# EAGLE design Simple (EAGLE 7.7.0)
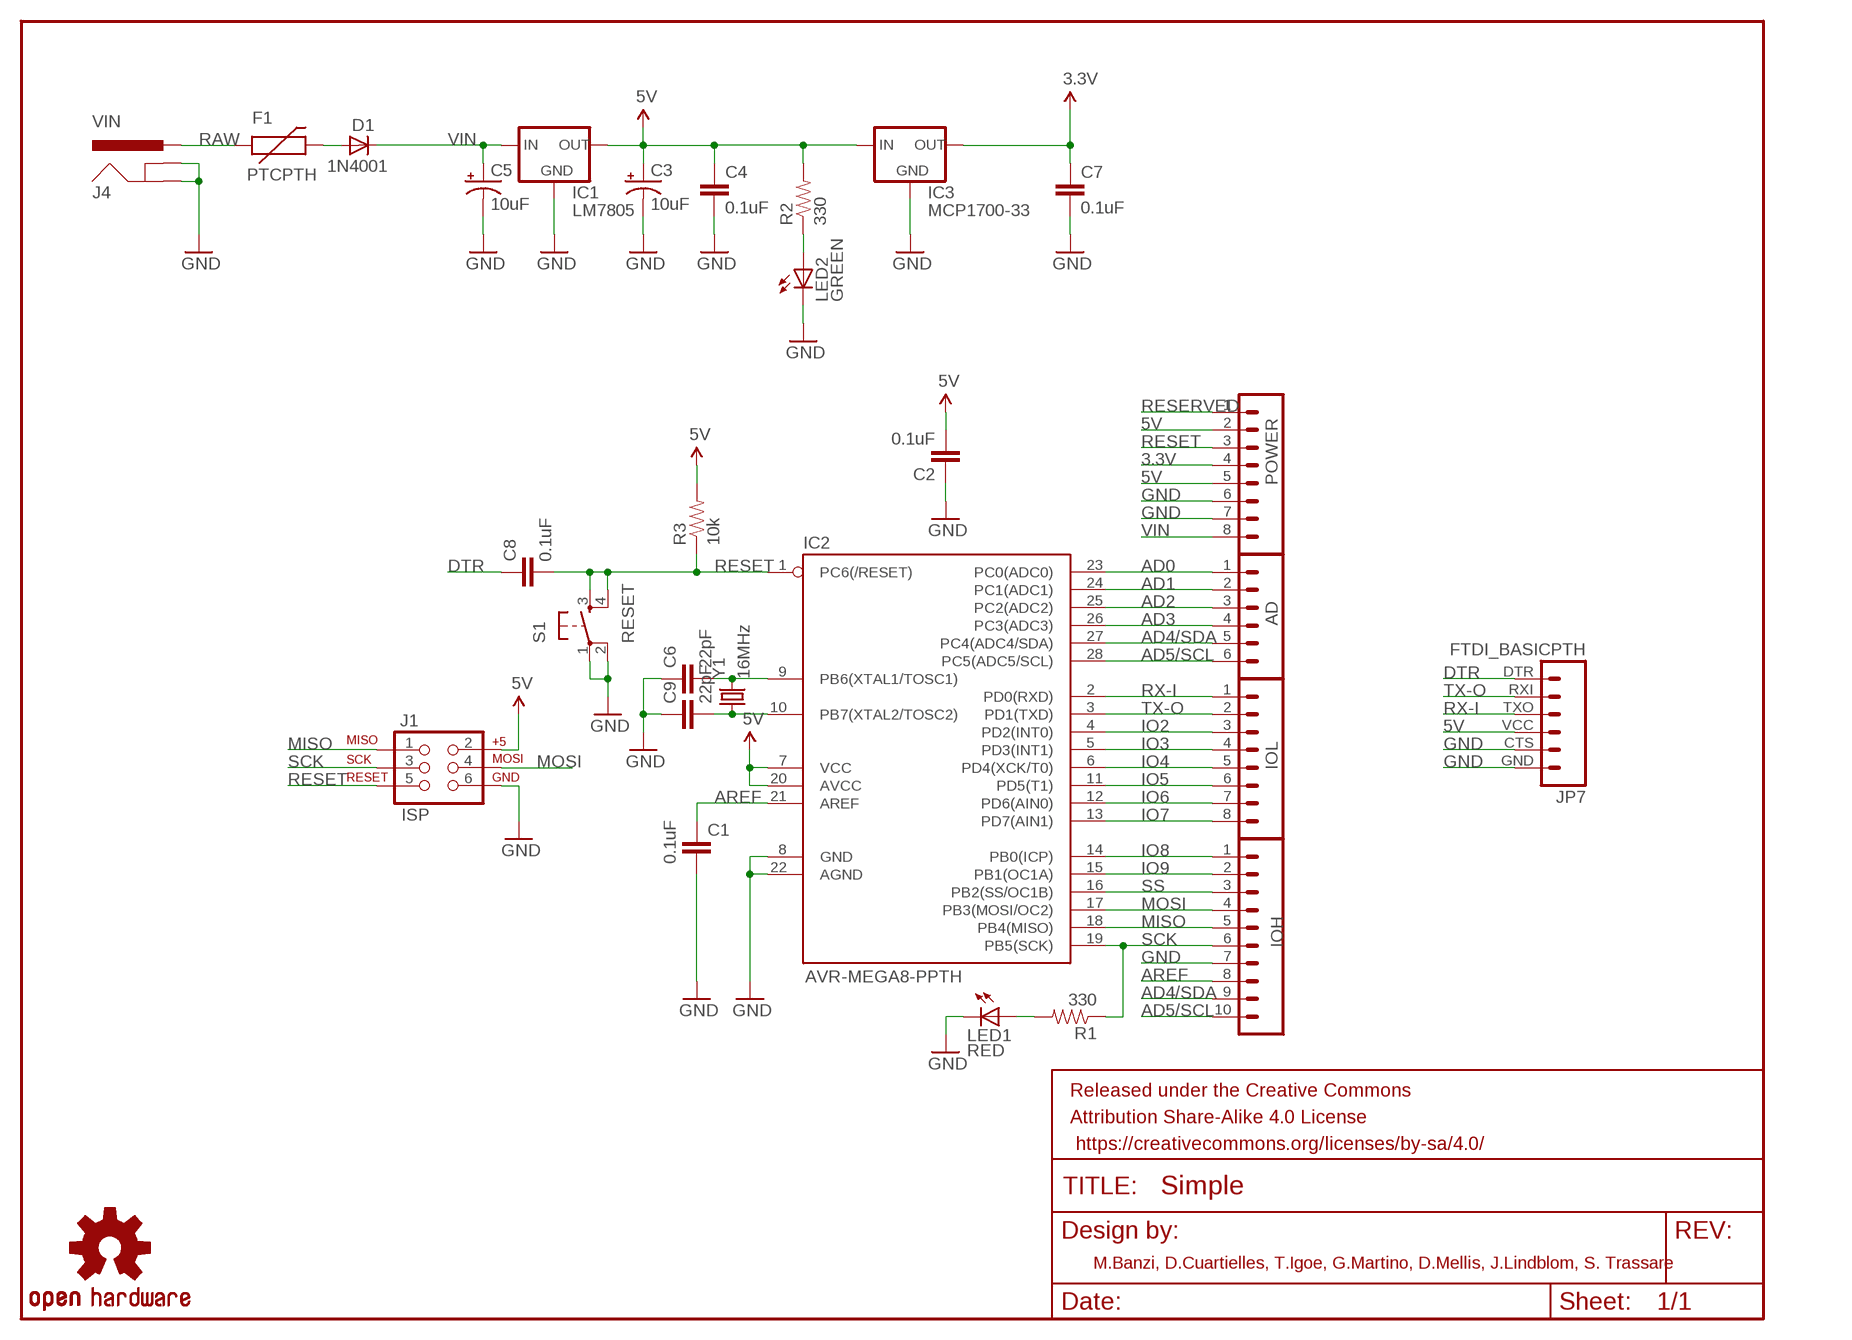
[diagram p0: schematic, sheet 1]

## Parts
AD  M06SIP  [1X06]
C1  0.1uF  CAPPTH2  [CAP-PTH-SMALL2]
C2  0.1uF  CAPPTH2  [CAP-PTH-SMALL2]
C3  10uF  CAP_POLPTH2  [CPOL-RADIAL-10UF-25V]
C4  0.1uF  CAPPTH2  [CAP-PTH-SMALL2]
C5  10uF  CAP_POLPTH2  [CPOL-RADIAL-10UF-25V]
C6  22pF  CAPPTH2  [CAP-PTH-SMALL2]
C7  0.1uF  CAPPTH2  [CAP-PTH-SMALL2]
C8  0.1uF  CAPPTH2  [CAP-PTH-SMALL2]
C9  22pF  CAPPTH2  [CAP-PTH-SMALL2]
D1  1N4001  DIODEPTH  [DIODE-1N4001]
F1  PTCPTH  [PTC]
FRAME2  FRAME-LETTER  [CREATIVE_COMMONS]
IC1  LM7805  V_REG_78XX-TO-220  [TO-220-ALT]
IC2  AVR-MEGA8-PPTH  [DIL28-3]
IC3  MCP1700-33  V_REG_78XXTO-92  [TO-92]
IOH  IOH  CONN_10"  [1X10]
IOL  M081X08  [1X08]
J1  ISP  AVR_SPI_PRG_6PTH  [2X3]
J4  VIN  POWER_JACKPTH_LOCK  [POWER_JACK_PTH_LOCK]
JP7  FTDI_BASICPTH  [FTDI_BASIC]
LED1  RED  LED5MM  [LED5MM]
LED2  GREEN  LED5MM  [LED5MM]
POWER  POWER  M081X08  [1X08]
R1  330  RESISTORAXIAL-0.3  [AXIAL-0.3]
R2  330  RESISTORAXIAL-0.3  [AXIAL-0.3]
R3  10k  RESISTORAXIAL-0.3  [AXIAL-0.3]
S1  RESET  TAC_SWITCHPTH  [TACTILE-PTH]
U$7  OSHW-LOGOM  [OSHW-LOGO-M]
Y1  16MHz  CRYSTALHC49US  [HC49US]

## Nets
3.3V: C7.1 IC3.3(OUT) POWER.4
5V: C2.2 C3.1(+) C4.1 IC1.OUT IC2.7(VCC) IC2.20(AVCC) IC3.2(IN) J1.2 JP7.VCC POWER.5 R2.P$2 R3.P$2
AD0: AD.1 IC2.23(PC0(ADC0))
AD1: AD.2 IC2.24(PC1(ADC1))
AD2: AD.3 IC2.25(PC2(ADC2))
AD3: AD.4 IC2.26(PC3(ADC3))
AD4/SDA: AD.5 IC2.27(PC4(ADC4/SDA)) IOH.9
AD5/SCL: AD.6 IC2.28(PC5(ADC5/SCL)) IOH.10
AREF: C1.1 IC2.21(AREF) IOH.8
DTR: C8.1 JP7.DTR
GND: C1.2 C2.1 C3.2(-) C4.2 C5.2(-) C6.1 C7.2 C9.1 IC1.GND IC2.8(GND) IC2.22(AGND) IC3.1(GND) IOH.7 J1.6 J4.GND J4.GNDBREAK JP7.CTS JP7.GND LED1.K(C) LED2.K(C) POWER.6 POWER.7 S1.1 S1.2
IO2: IC2.4(PD2(INT0)) IOL.3
IO3: IC2.5(PD3(INT1)) IOL.4
IO4: IC2.6(PD4(XCK/T0)) IOL.5
IO5: IC2.11(PD5(T1)) IOL.6
IO6: IC2.12(PD6(AIN0)) IOL.7
IO7: IC2.13(PD7(AIN1)) IOL.8
IO8: IC2.14(PB0(ICP)) IOH.1
IO9: IC2.15(PB1(OC1A)) IOH.2
MISO: IC2.18(PB4(MISO)) IOH.5 J1.1
MOSI: IC2.17(PB3(MOSI/OC2)) IOH.4 J1.4
N$1: LED1.A R1.P$2
N$2: LED2.A R2.P$1
N$3: C6.2 IC2.9(PB6(XTAL1/TOSC1)) Y1.2
N$4: C9.2 IC2.10(PB7(XTAL2/TOSC2)) Y1.1
N$6: D1.A F1.P$2
RAW: F1.P$1 J4.PWR
RESERVED: POWER.1
RESET: C8.2 IC2.1(PC6(/RESET)) J1.5 POWER.3 R3.P$1 S1.3 S1.4
RX-I: IC2.2(PD0(RXD)) IOL.1 JP7.TXO
SCK: IC2.19(PB5(SCK)) IOH.6 J1.3 R1.P$1
SS: IC2.16(PB2(SS/OC1B)) IOH.3
TX-O: IC2.3(PD1(TXD)) IOL.2 JP7.RXI
VIN: C5.1(+) D1.C IC1.IN POWER.8
Unconnected: POWER.2

## Notes on the sheet
- M.Banzi, D.Cuartielles, T.Igoe, G.Martino, D.Mellis, J.Lindblom, S. Trassare

## Library data of the parts
AD = SparkFun:M06: Header 6 Standard 6-pin 0.1" header. Use with straight break away headers (SKU : PRT-00116), right angle break away headers (PRT-00553), swiss pins (PRT-00743), machine pins (PRT-00117), and female headers (PRT-00115). Molex polarized connector foot print use with SKU : PRT-08094 with associated crimp pins and housings. NOTES ON THE VARIANTS LOCK and LOCK_LONGPADS... This footprint was designed to help hold the alignment of a through-hole component (i.e. 6-pin header) while soldering it into place. You may notice that each hole has been shifted either up or down by 0.005 of an inch from it's more standard position (which is a perfectly straight line). This slight alteration caused the pins (the squares in the middle) to touch the edges of the holes. Because they are alternating, it causes a "brace" to hold the component in place. 0.005 has proven to be the perfect amount of "off-center" position when using our standard breakaway headers. Although looks a little odd when you look at the bare footprint, once you have a header in there, the alteration is very hard to notice. Also, if you push a header all the way into place, it is covered up entirely on the bottom side. This idea of altering the position of holes to aid alignment will be further integrated into the Sparkfun Library for other footprints. It can help hold any component with 3 or more connection pins.
C1 C2 C4 C6-C9 = SparkFun:CAP: Capacitor Standard 0603 ceramic capacitor, and 0.1" leaded capacitor.
C3 C5 = SparkFun:CAP_POL: Capacitor Polarized These are standard SMD and PTH capacitors. Normally 10uF, 47uF, and 100uF in electrolytic and tantalum varieties. Always verify the external diameter of the through hole cap, it varies with capacity, voltage, and manufacturer. The EIA devices should be standard.
D1 = SparkFun:DIODE: Diode These are standard reverse protection diodes and small signal diodes. SMA package can handle up to about 1A. SOD-323 can handle about 200mA. What the SOD-323 package when ordering, there are some mfgs out there that are 5-pin packages.
F1 = SparkFun:PTC: Resettable Fuse PTC Resettable Fuse. Spark Fun Electronics SKU : COM-08357
FRAME2 = SparkFun-Aesthetics:FRAME-LETTER: Schematic Frame - Letter Standard 8.5x11 US Letter frame
IC1 IC3 = SparkFun:V_REG_78XX: Voltage Regulator Standard 7805 5V regulator. IGO (Input Ground Output). Spark Fun Electronics SKU : COM-00107
IC2 = SparkFun:AVR-MEGA8-P: MICROCONTROLLER 8 Kbytes FLASH 1 kbytes SRAM 512 bytes EEPROM USART 4-channel 10 bit ADC 2-channel 8 bit ADC
IOH = SparkFun-Connectors:CONN_10: Multi connection point. Often used as Generic Header-pin footprint for 0.1 inch spaced/style header connections On any of the 0.1 inch spaced packages, you can populate with these: Break Away Headers - Straight <https://www.sparkfun.com/products/116> (PRT-00116) Break Away Male Headers - Right Angle <https://www.sparkfun.com/products/553> (PRT-00553) Female Headers <https://www.sparkfun.com/products/115> (PRT-00115) Break Away Headers - Machine Pin <https://www.sparkfun.com/products/117> (PRT-00117) Break Away Female Headers - Swiss Machine Pin <https://www.sparkfun.com/products/743> (PRT-00743) Arduino Stackable Header - 10 Pin <https://www.sparkfun.com/products/11376> (PRT-11376) For SCREWTERMINALS and SPRING TERMINALS visit here: Screw Terimnals on SparkFun.com <https://www.sparkfun.com/search/results?term=Screw+Terminals> (5mm/3.5mm/2.54mm spacing) This device is also useful as a general connection point to wire up your design to another part of your project. Our various solder wires solder well into these plated through hole pads. Hook-Up Wire - Assortment (Stranded, 22 AWG) <https://www.sparkfun.com/products/11375> (PRT-11375) Hook-Up Wire - Assortment (Solid Core, 22 AWG) <https://www.sparkfun.com/products/11367> (PRT-11367) View the entire wire category on our website here <https://www.sparkfun.com/categories/141> Special notes: Molex polarized connector foot print use with SKU : PRT-08231 with associated crimp pins and housings. 1MM SMD Version SKU: PRT-10208 NOTES ON THE VARIANTS LOCK and LOCK_LONGPADS... This footprint was designed to help hold the alignment of a through-hole component (i.e. 6-pin header) while soldering it into place. You may notice that each hole has been shifted either up or down by 0.005 of an inch from it's more standard position (which is a perfectly straight line). This slight alteration caused the pins (the squares in the middle) to touch the edges of the holes. Because they are alternating, it causes a "brace" to hold the component in place. 0.005 has proven to be the perfect amount of "off-center" position when using our standard breakaway headers. Although looks a little odd when you look at the bare footprint, once you have a header in there, the alteration is very hard to notice. Also,if you push a header all the way into place, it is covered up entirely on the bottom side.; PROD_ID: CONN-11563
IOL POWER = SparkFun:M08: Header 8 Standard 8-pin 0.1" header. Use with straight break away headers (SKU : PRT-00116), right angle break away headers (PRT-00553), swiss pins (PRT-00743), machine pins (PRT-00117), and female headers (PRT-00115).
J1 = SparkFun:AVR_SPI_PRG_6: AVR ISP 6 Pin This is the reduced ISP connector for AVR programming. Common on Arduino. This footprint will take up less PCB space and can be used with a 10-pin to 6-pin adapter such as SKU: BOB-08508
J4 = SparkFun:POWER_JACK: Power Jack This is the standard 5.5mm barrel jack for power. The PTH is the most common, proven, reliable, footprint. All others are experimental. The Slot footprint only works if the mill layer is transmitted to the PCB fab house so be warned. Spark Fun Electronics SKU : PRT-00119. Mating wall wart : TOL-00298 (and others)
JP7 = SparkFun:FTDI_BASIC: FTDI Basic: 3.3V and 5V
LED1 LED2 = SparkFun:LED: LEDs Standard schematic elements and footprints for 5mm, 3mm, 1206, and 0603 sized LEDs. 5mm - Spark Fun Electronics SKU : COM-00529 (and others)
R1-R3 = SparkFun:RESISTOR: Resistor Basic schematic elements and footprints for 0603, 1206, and PTH resistors.
S1 = SparkFun:TAC_SWITCH: Momentary Switch Button commonly used for reset or general input. Spark Fun Electronics SKU : COM-00097
U$7 = SparkFun:OSHW-LOGO: Open Source Hardware Logo This logo indicates the piece of hardware it is found on incorporates a OSHW license and/or adheres to the definition of open source hardware found here: http://freedomdefined.org/OSHW
Y1 = SparkFun:CRYSTAL: Crystals Various standard crystals. Proven footprints. Spark Fun Electronics SKU : COM-00534

## Net classes
0 default: width 0.152 mm, drill 0.305 mm, clearance 0.152 mm

## Board
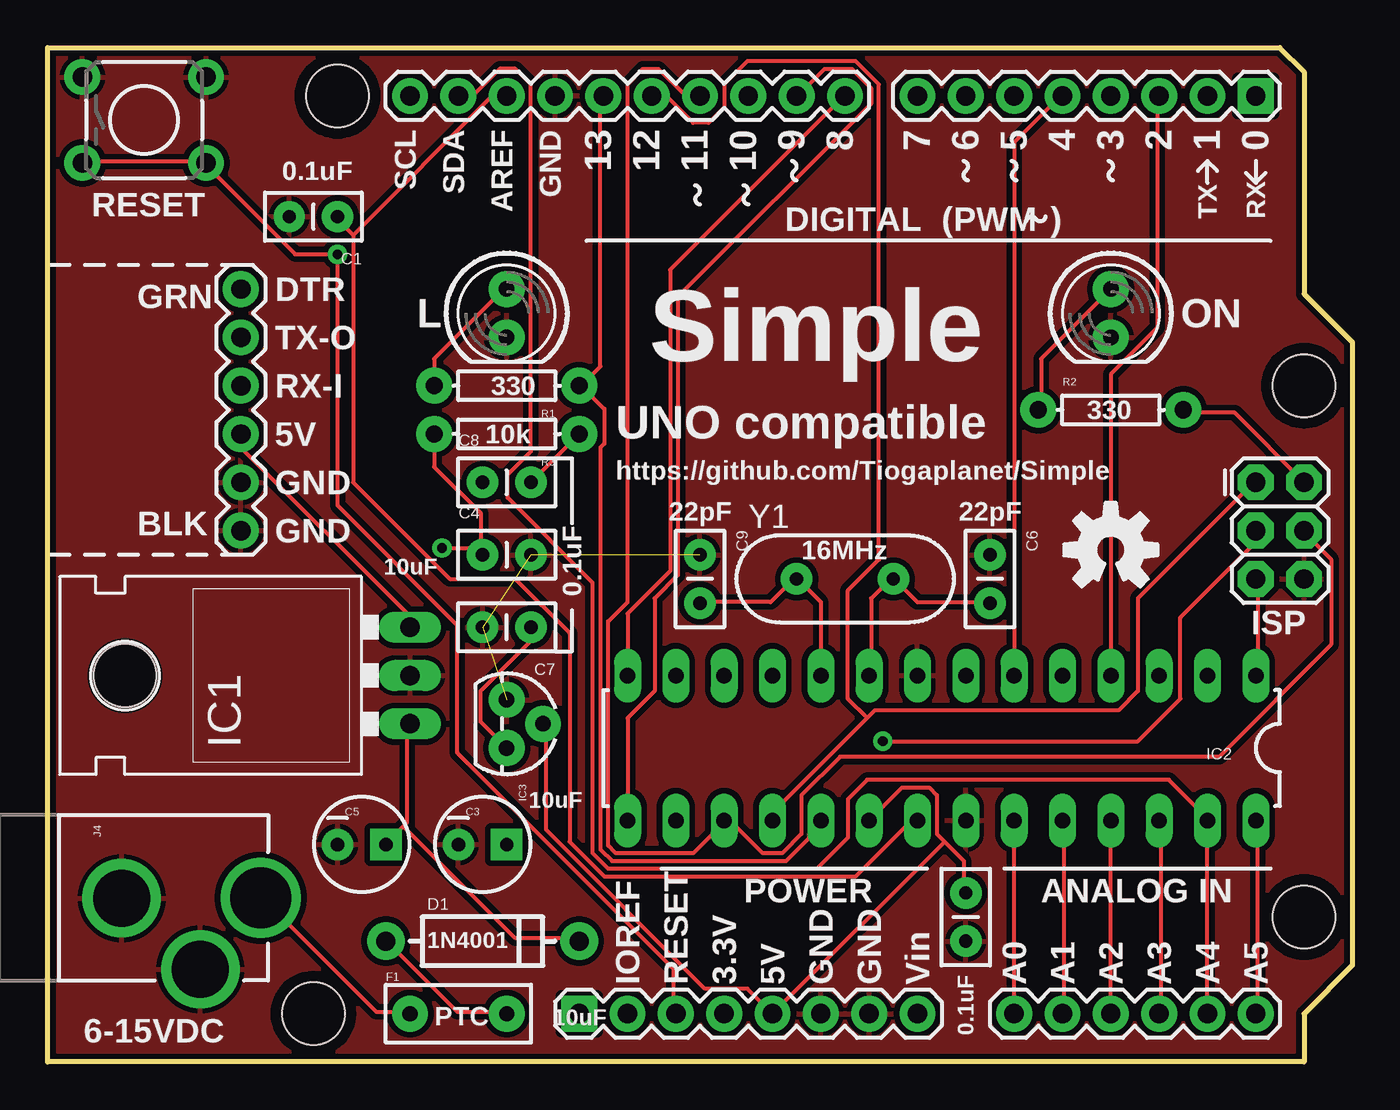
[diagram p1: board, top side]
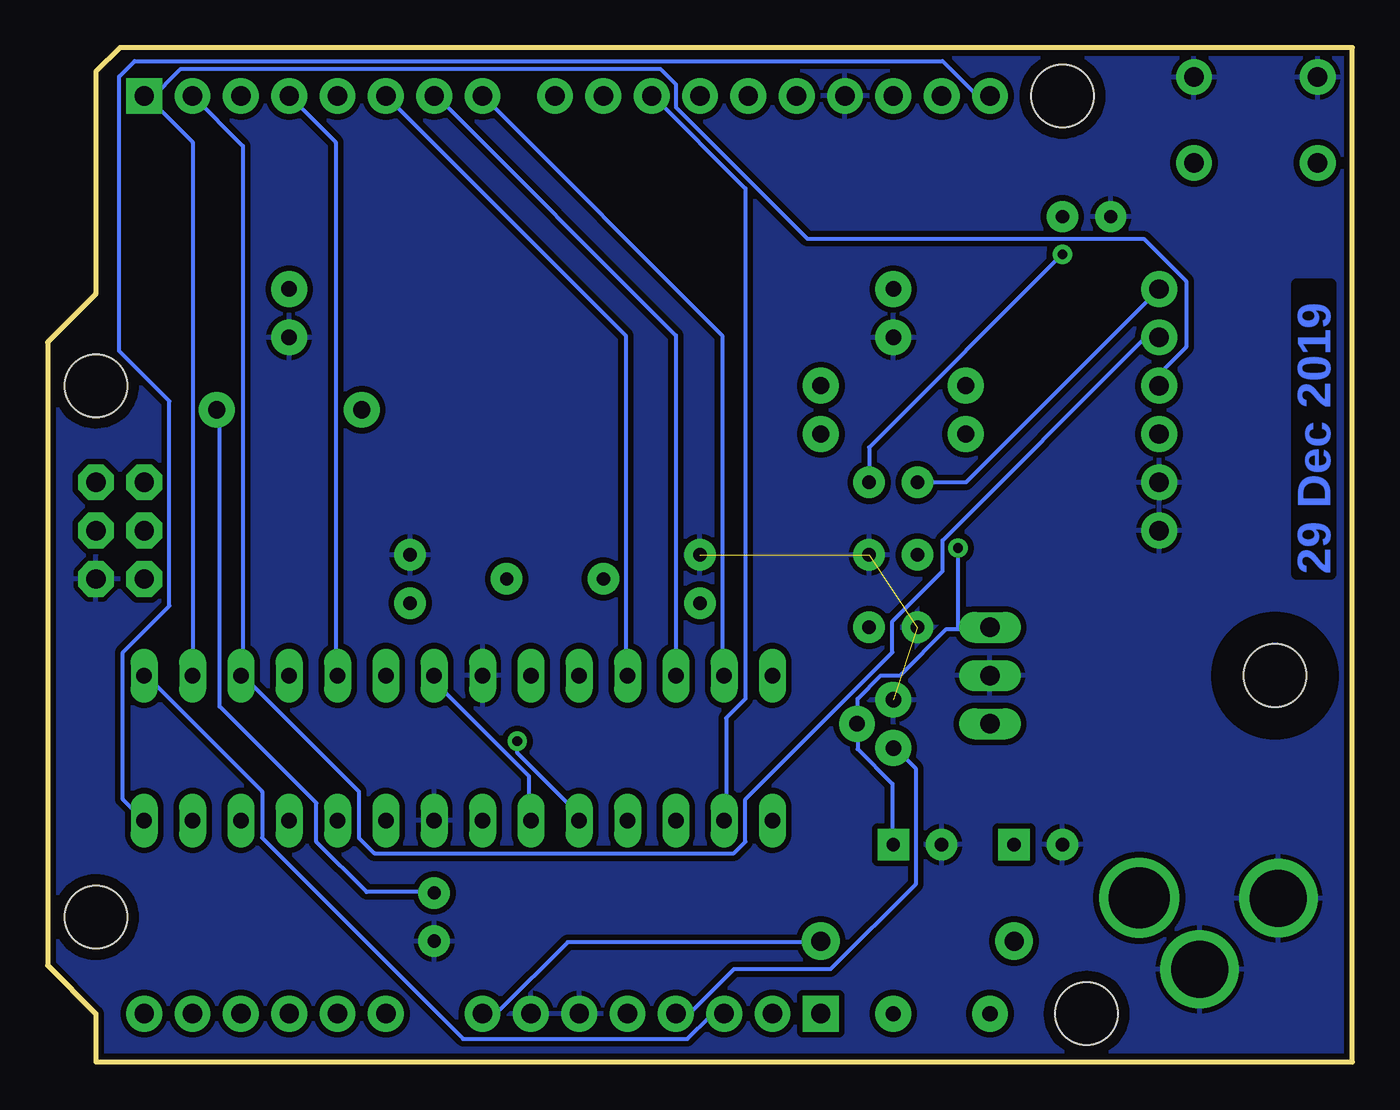
[diagram p2: board, bottom side, seen from below]

Size 68.58 x 53.34 mm. Coordinates in mm from the lower left corner, seen from the top.
Outline: 0,53.34 64.77,53.34 66.04,52.07 66.04,40.39 68.58,37.85 68.58,5.08 66.04,2.54 66.04,0 0,0 0,53.34
Copper layers (1*16): Top 0.035mm / dielectric 1.5mm / Bottom 0.035mm
Design rules "SparkFun *": minimum track width 8mil, minimum drill 20mil, track to track 8mil, track to pad 8mil, pad to pad 8mil, via to via 8mil, smd to smd 8mil, copper to edge 8mil, drill to drill 8mil, minimum pad ring 12mil, minimum via ring 10mil, stop-mask expansion 4mil, vias tented up to drill 20mil, thermal gap 10mil

### Footprints (pad centres in the part's own frame; a part is rotated, then mirrored left to right if it is on the bottom)
1X06 = drill 1.016 pad 1.88: 1 0,0; 2 2.54,0; 3 5.08,0; 4 7.62,0; 5 10.16,0; 6 12.7,0
CAP-PTH-SMALL2 = drill 0.7 pad 1.651: 1 0,0; 2 2.54,0
CPOL-RADIAL-10UF-25V = drill 0.7 pad 1.651 square: 1 1.27,0 | drill 0.7 pad 1.651: 2 -1.27,0
DIODE-1N4001 = drill 1 pad 1.981: A -5.08,0; C 5.08,0
PTC = drill 0.8 pad 1.88: P$1 -2.54,0; P$2 2.54,0
TO-220-ALT = drill 1.016 long: GND 0,-3.81; IN -2.54,-3.81; OUT 2.54,-3.81 | hole 3.302: 0,11.176
DIL28-3 = drill 0.813 long: 1 -16.51,-3.81; 2 -13.97,-3.81; 3 -11.43,-3.81; 4 -8.89,-3.81; 5 -6.35,-3.81; 6 -3.81,-3.81; 7 -1.27,-3.81; 8 1.27,-3.81; 9 3.81,-3.81; 10 6.35,-3.81; 11 8.89,-3.81; 12 11.43,-3.81; 13 13.97,-3.81; 14 16.51,-3.81; 15 16.51,3.81; 16 13.97,3.81; 17 11.43,3.81; 18 8.89,3.81; 19 6.35,3.81; 20 3.81,3.81; 21 1.27,3.81; 22 -1.27,3.81; 23 -3.81,3.81; 24 -6.35,3.81; 25 -8.89,3.81; 26 -11.43,3.81; 27 -13.97,3.81; 28 -16.51,3.81
TO-92 = drill 0.813 pad 1.88: 1 -1.27,0; 2 0,1.905; 3 1.27,0
1X10 = drill 1.016 pad 1.88: 1 0,0; 2 2.54,0; 3 5.08,0; 4 7.62,0; 5 10.16,0; 6 12.7,0; 7 15.24,0; 8 17.78,0; 9 20.32,0; 10 22.86,0
1X08 = drill 1.016 pad 1.88 square: 1 0,0 | drill 1.016 pad 1.88: 2 2.54,0; 3 5.08,0; 4 7.62,0; 5 10.16,0; 6 12.7,0; 7 15.24,0; 8 17.78,0
2X3 = drill 1.016 pad 1.88 octagon: 1 0,0; 2 0,2.54; 3 2.54,0; 4 2.54,2.54; 5 5.08,0; 6 5.08,2.54
POWER_JACK_PTH_LOCK = drill 2.997 pad 4.115: GND 0.025,6.557; GNDBREAK 3.762,10.7 | drill 3.2 pad 4.115: PWR 0,13.878
STAND-OFF = hole 3.302: 0,0
FTDI_BASIC = drill 1.016 pad 1.88: CTS 10.16,0; DTR 0,0; GND 12.7,0; RXI 2.54,0; TXO 5.08,0; VCC 7.62,0
LED5MM = drill 0.813 pad 1.88: A -1.27,0; K 1.27,0
AXIAL-0.3 = drill 0.9 pad 1.88: P$1 -3.81,0; P$2 3.81,0
TACTILE-PTH = drill 1.016 pad 1.88: 1 -3.251,2.261; 2 3.251,2.261; 3 -3.251,-2.261; 4 3.251,-2.261
HC49US = drill 0.7 pad 1.651: 1 -2.54,0; 2 2.54,0

### Placement (x,y rotation side)
AD  50.8,2.54 0 top
C1  15.24,44.45 180 top
C2  48.26,6.35 90 top
C3  22.86,11.43 0 top
C4  22.86,26.67 0 top
C5  16.51,11.43 0 top
C6  49.53,26.67 270 top
C7  25.4,22.86 180 top
C8  22.86,30.48 0 top
C9  34.29,26.67 270 top
D1  22.86,6.35 0 top
F1  21.59,2.54 0 top
FRAME2  -5.08,-24.13 0 top  (outside the outline)
IC1  15.24,20.32 90 top
IC2  46.99,16.51 180 top
IC3  24.13,17.78 270 top
IOH  41.91,50.8 180 top
IOL  63.5,50.8 180 top
J1  63.5,30.48 270 top
J4  -2.67,8.64 270 top
JP1  STAND-OFF  [STAND-OFF]  13.97,2.54 0 top
JP2  STAND-OFF  [STAND-OFF]  66.04,7.62 0 top
JP3  STAND-OFF  [STAND-OFF]  66.04,35.56 0 top
JP6  STAND-OFF  [STAND-OFF]  15.24,50.8 0 top
JP7  10.16,40.64 270 top
LED1  24.13,39.37 270 top
LED2  55.88,39.37 270 top
POWER  27.94,2.54 0 top
R1  24.13,35.56 180 top
R2  55.88,34.29 0 top
R3  24.13,33.02 180 top
S1  5.08,49.53 0 top
U$7  55.88,26.92 0 top
Y1  41.91,25.4 0 top

### Tracks (layer width: path | path; a pad name or v marks a point on that pad's centre or on a via)
3.3V
  Top 0.203: C7.1 25.4,22.15 22.76,19.51 22.76,17.88 IC3.3
  Bottom 0.203: POWER.4 35.56,2.64 34.75,2.64 32.51,4.88 27.43,4.88 22.96,9.35 22.96,15.44 23.98,16.46 IC3.3
5V  (via drill 0.51)
  Top 0.203: 22.76,27.03 22.76,28.85 20.32,31.29 R3.P$2 | 22.76,27.03 22.76,26.82 C4.1 22.76,27.03 | JP7.VCC 10.16,32.31 18.9,23.57 18.9,22.96 IC1.OUT | v20.73,27.03 22.76,27.03 | J1.2 62.38,34.14 59.74,34.14 R2.P$2 | 47.14,11.58 46.74,11.99 46.74,14.02 46.33,14.43 44.91,14.43 IC2.20 | 47.14,11.58 48.16,10.57 48.16,8.94 C2.2 | 47.14,11.58 POWER.5 36.78,3.86 34.54,3.86 26.21,12.19 26.21,17.68 IC3.2
  Bottom 0.203: 20.73,22.76 21.34,22.76 23.77,20.32 24.79,20.32 26.01,19.1 26.01,17.88 IC3.2 26.01,17.68 26.01,16.46 24.18,14.63 24.18,11.58 C3.1 | 20.73,22.76 19.1,22.76 IC1.OUT | 20.73,22.76 v20.73,27.03 | IC2.20 43.28,12.8 43.28,15.04 48.16,19.91 48.16,20.32 IC2.7 | R2.P$2 59.54,34.14 59.54,18.69 54.46,13.61 54.46,11.58 51.82,8.94 48.36,8.94 C2.2
AD0
  Top 0.203: AD.1 IC2.23
AD1
  Top 0.203: IC2.24 53.44,12.6 53.44,2.64 AD.2
AD2
  Top 0.203: AD.3 IC2.25
AD3
  Top 0.203: IC2.26 58.52,12.6 58.52,2.64 AD.4
AD4/SDA
  Top 0.203: AD.5 IC2.27 60.96,12.8 58.93,14.83 43.08,14.83 42.06,13.82 42.06,11.79 40.44,10.16 29.46,10.16 28.65,10.97 28.65,25.2 24.18,29.67 24.18,30.89 25.4,32.11 25.4,51.41 24.59,52.22 23.77,52.22 22.35,50.8 IOH.9
AD5/SCL
  Top 0.203: IC2.28 63.6,12.6 63.6,2.64 AD.6
  Bottom 0.203: IOH.10 19.71,50.8 21.54,52.63 64.01,52.63 64.82,51.82 64.82,37.39 62.18,34.75 62.18,23.98 64.62,21.54 64.62,13.82 IC2.28
AREF
  Top 0.203: 16.05,43.48 16.05,30.48 21.13,25.4 24.59,25.4 27.43,22.55 27.43,11.58 29.26,9.75 42.47,9.75 45.31,12.6 45.72,12.6 IC2.21 | 16.05,43.48 15.24,44.3 C1.1 | IOH.8 23.37,50.8 16.05,43.48
DTR
  Bottom 0.203: C8.1 20.32,30.48 JP7.DTR
GND  (3 unrouted)
  pour Bottom (isolate 0.305): 0,53.34 0,0 66.04,0 66.04,2.54 68.58,5.08 68.58,38.1 66.04,40.64 66.04,52.07 64.77,53.34
  pour Top (isolate 0.305): 0,53.34 0,0 66.04,0 66.04,2.54 68.58,5.08 68.58,38.1 66.04,40.64 66.04,52.07 64.77,53.34
IO2
  Top 0.203: IC2.4 55.88,36.17 58.32,38.61 58.32,50.8 IOL.3
IO3
  Bottom 0.203: IOL.4 53.44,48.36 53.44,20.32 IC2.5
IO4
  Top 0.203: IC2.6 50.8,48.36 53.24,50.8 IOL.5
IO5
  Bottom 0.203: IOL.6 38.2,38.2 38.2,20.32 IC2.11
IO6
  Bottom 0.203: IC2.12 35.56,38.2 48.16,50.8 IOL.7
IO7
  Bottom 0.203: IOL.8 33.12,38.2 33.12,20.32 IC2.13
IO8
  Top 0.203: IC2.14 30.48,23.57 32.72,25.81 32.72,41.66 41.86,50.8 IOH.1
IO9
  Top 0.203: IC2.15 30.48,18.09 31.9,19.51 31.9,24.38 33.12,25.6 33.12,40.23 43.28,50.39 43.28,51.21 42.27,52.22 40.84,52.22 39.42,50.8 IOH.2
MISO
  Top 0.203: 43.08,18.09 43.48,18.49 56.29,18.49 57.3,19.51 57.3,24.38 63.4,30.48 J1.1 | 43.08,18.09 38.2,13.21 38.2,12.8 IC2.18 | IOH.5 32.51,50.8 33.93,49.38 34.75,49.38 35.56,50.19 35.56,51.41 36.78,52.63 42.47,52.63 43.69,51.41 43.69,26.42 42.06,24.79 42.06,19.1 43.08,18.09
MOSI
  Top 0.203: 35.56,12.6 35.97,12.6 37.59,10.97 38.61,10.97 39.62,11.99 39.62,14.02 41.66,16.05 61.57,16.05 67.46,21.95 67.46,26.42 66.04,27.84 J1.4 | IOH.4 33.53,50.8 32.11,52.22 31.29,52.22 30.48,51.41 30.48,24.18 29.46,23.16 29.46,11.38 29.87,10.97 33.93,10.97 35.56,12.6 | 35.56,12.6 IC2.17
N$1
  Top 0.203: R1.P$2 20.32,36.98 23.98,40.64 LED1.A
N$2
  Top 0.203: LED2.A 52.22,36.98 52.22,34.34 R2.P$1
N$3
  Top 0.203: IC2.9 43.28,20.32 43.28,24.38 44.3,25.4 Y1.2 44.5,25.4 45.72,24.18 49.38,24.18 C6.2
N$4
  Top 0.203: IC2.10 40.64,24.18 39.42,25.4 Y1.1 39.22,25.4 38,24.18 34.34,24.18 C9.2
N$6
  Top 0.203: F1.P$2 23.98,2.64 21.54,2.64 17.88,6.3 D1.A
RAW
  Top 0.203: F1.P$1 18.9,2.64 17.27,2.64 11.38,8.53 J4.PWR
RESET  (via drill 0.51)
  Top 0.203: R3.P$1 C8.2 | S1.3 1.83,47.35 8.33,47.35 S1.4 8.33,47.14 13.01,42.47 v15.24,42.47 15.24,29.26 21.54,22.96 21.54,16.26 32.92,4.88 32.92,2.64 POWER.3 | IC2.1 63.6,20.32 63.6,25.4 J1.5
  Bottom 0.203: C8.2 25.4,32.31 v15.24,42.47 | POWER.3 33.12,2.44 33.73,2.44 34.95,1.22 46.74,1.22 57.3,11.79 57.3,14.22 63.4,20.32 IC2.1
RX-I
  Bottom 0.203: IC2.2 60.96,48.36 63.2,50.6 | 63.2,50.6 63.4,50.8 IOL.1 63.2,50.6 | JP7.TXO 10.16,36.17 8.74,37.59 8.74,41.05 10.97,43.28 28.65,43.28 35.56,50.19 35.56,51.41 36.37,52.22 61.57,52.22 63.2,50.6
SCK  (via drill 0.51)
  Top 0.203: 28.04,35.56 29.26,34.34 29.26,32.51 29.06,32.31 29.06,11.18 29.67,10.57 38.81,10.57 40.03,11.79 40.03,11.99 40.64,12.6 IC2.19 | 28.04,35.56 29.06,36.58 29.06,50.8 IOH.6 | 28.04,35.56 R1.P$1 | v43.89,16.87 57.3,16.87 59.54,19.1 59.54,23.37 63.4,27.23 63.4,27.84 J1.3
  Bottom 0.203: v43.89,16.87 43.89,16.26 40.64,13.01 IC2.19
SS
  Bottom 0.203: IC2.16 32.92,12.8 32.92,18.09 31.9,19.1 31.9,45.92 36.78,50.8 IOH.3
TX-O
  Bottom 0.203: 58.32,20.32 58.32,48.16 IOL.2 | 58.32,20.32 52.22,14.22 52.22,11.79 51.41,10.97 32.51,10.97 31.9,11.58 31.9,13.82 24.18,21.54 24.18,23.16 21.54,25.81 21.54,27.43 10.97,38 10.16,38 JP7.RXI | 58.32,20.32 IC2.3
VIN
  Top 0.203: 18.69,12.39 17.88,11.58 C5.1 | 18.69,12.39 18.9,12.6 18.9,17.68 IC1.IN | 18.69,12.39 24.59,6.5 27.84,6.5 D1.C
  Bottom 0.203: POWER.8 45.72,2.64 44.91,2.64 41.25,6.3 28.04,6.3 D1.C

### Text on the board
Bottom: 29 Dec 2019
tPlace: SCL | SDA | AREF | GND | 13 | 12 | 11 | 10 | 9 | 8 | 7 | 6 | 5 | 4 | 3 | 2 | 1 | 0 | 0.1uF | RESET | DIGITAL | (PWM | ) | TX | RX | GRN | DTR | L | Simple | ON | TX-O | RX-I | UNO compatible | 5V | https://github.com/Tiogaplanet/Simple | GND | BLK | 0.1uF | 22pF | 22pF | GND | 10uF | 16MHz | ISP | 10uF | POWER | ANALOG IN | 1N4001 | IOREF | RESET | 3.3V | 5V | GND | GND | Vin | A0 | A1 | A2 | A3 | A4 | A5 | PTC | 10uF | 6-15VDC | 0.1uF